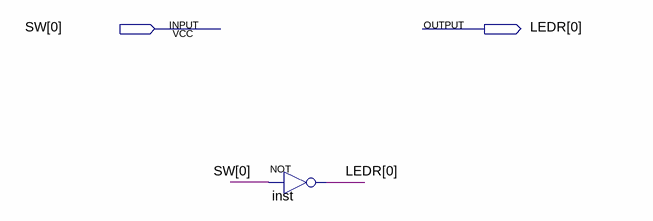
[diagram p0: schematic sheet]
// Quartus schematic LED_Schematic.bdf as structural Verilog: 1 symbols, 2 pins
module LED_Schematic (
  input  [0:0] SW,
  output [0:0] LEDR
);

  not inst (LEDR[0], SW[0]);
endmodule
